# EasyEDA schematic schematic.json
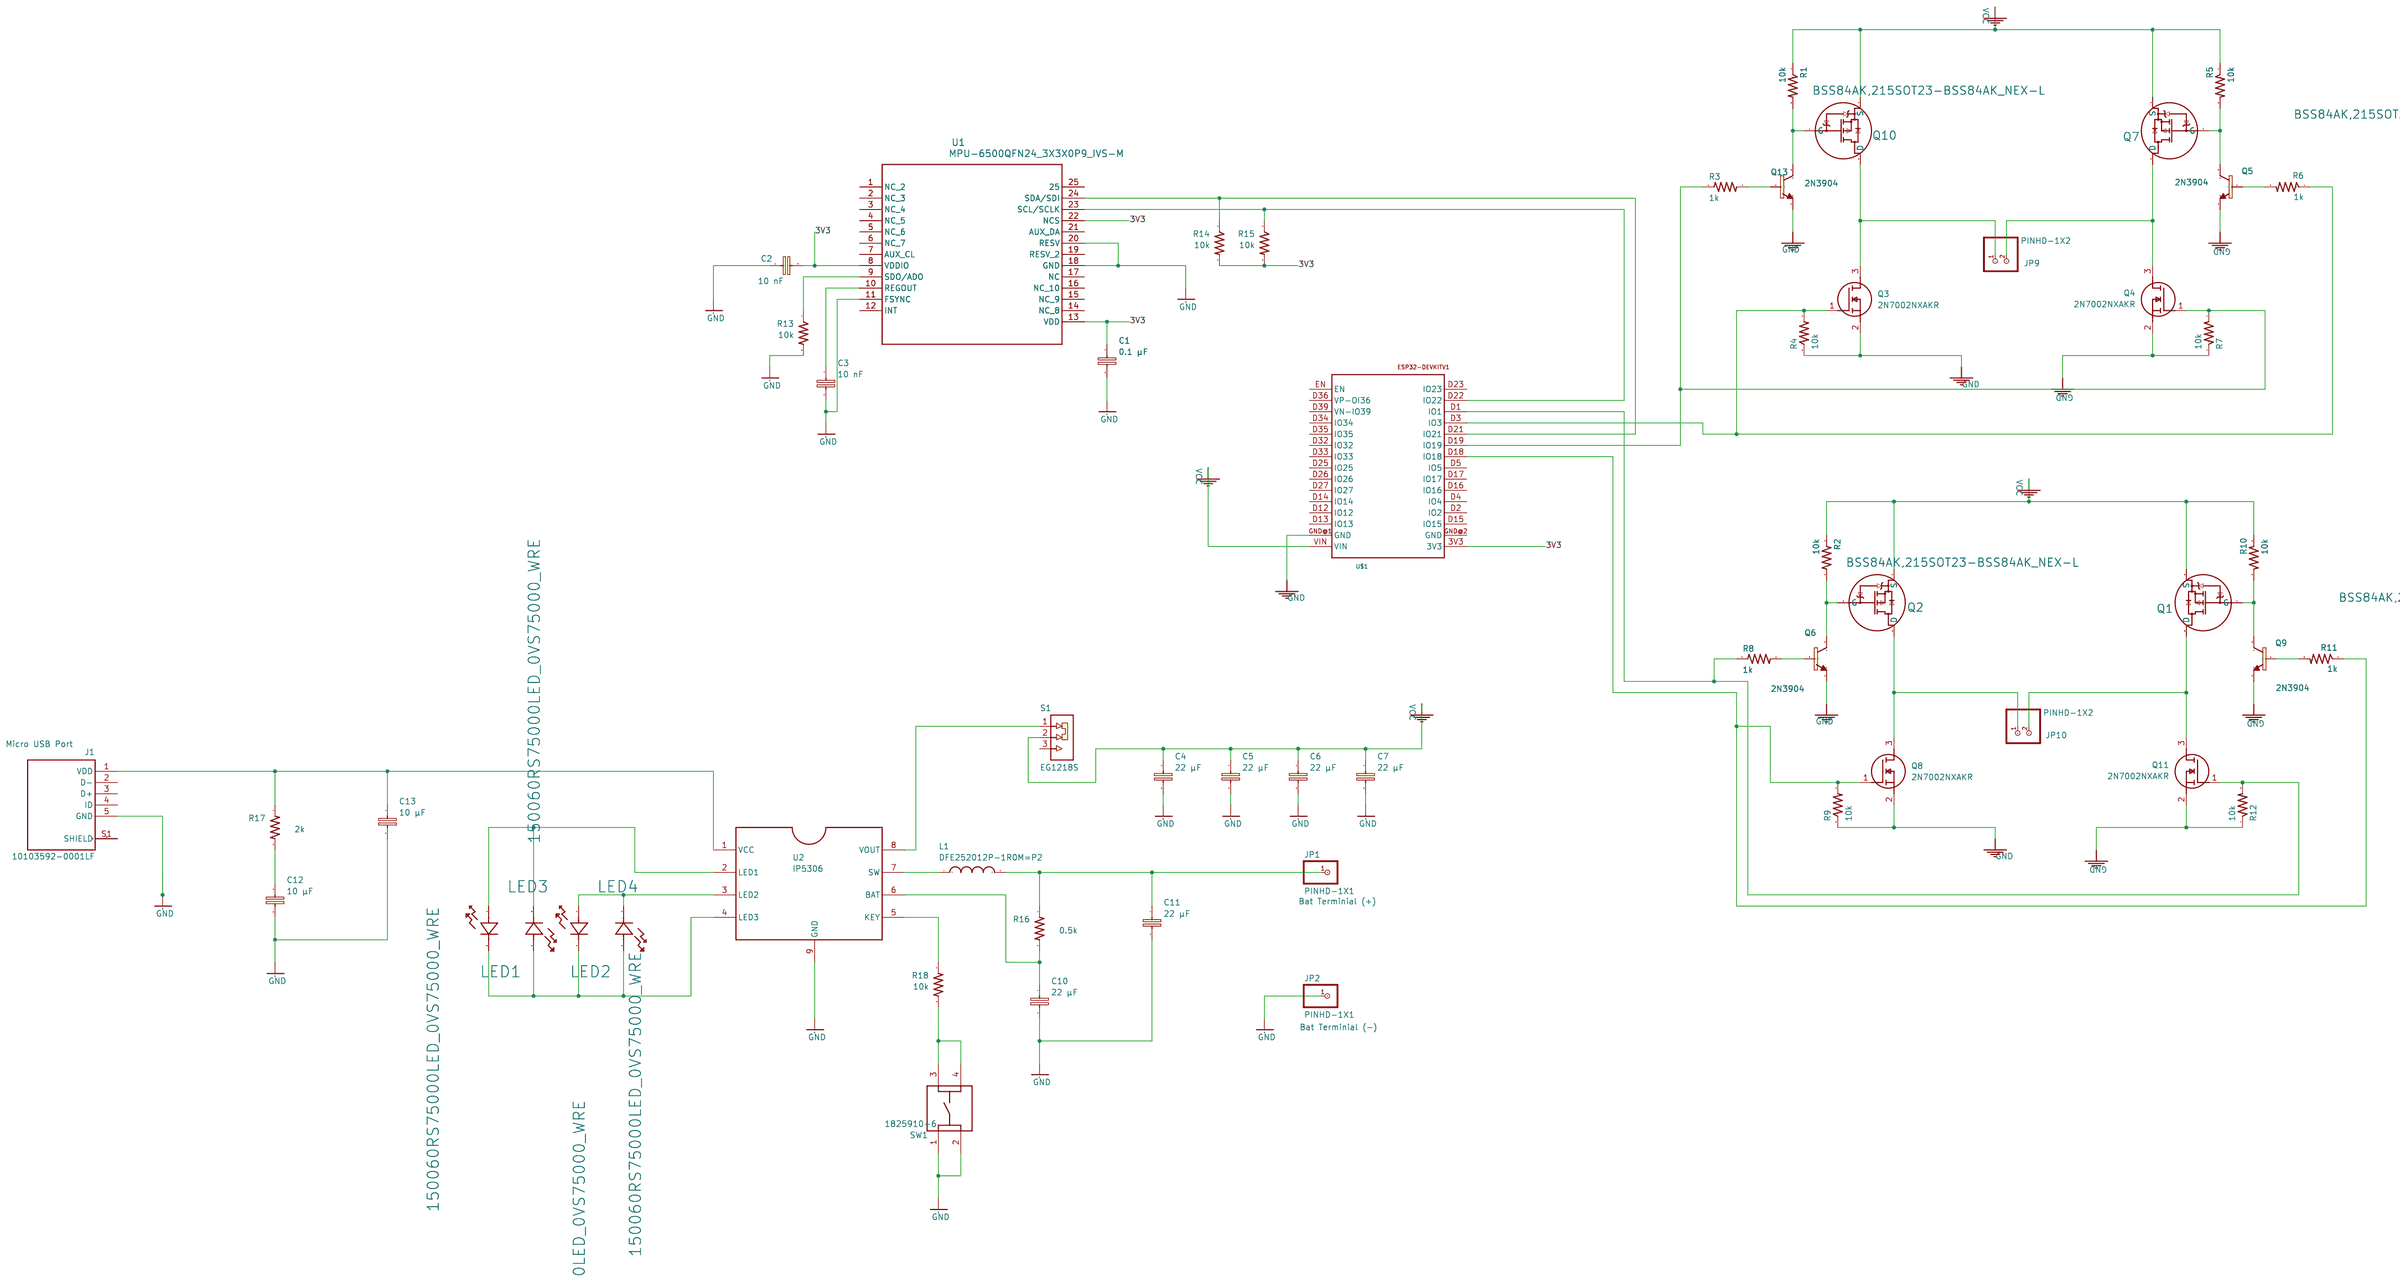
[diagram p0: schematic sheet]

## Parts
C1  0.1 µF  [CAPC2012X110]
C2  10 nF  [CAPC2012X110]
C3  10 nF  [CAPC2012X110]
C4  22 µF  [CAPC2012X110]
C5  22 µF  [CAPC2012X110]
C6  22 µF  [CAPC2012X110]
C7  22 µF  [CAPC2012X110]
C10  22 µF  [CAPC2012X110]
C11  22 µF  [CAPC2012X110]
C12  10 µF  [CAPC2012X110]
C13  10 µF  [CAPC2012X110]
J1  10103592-0001LF  [AMPHENOL_10103592-0001LF]
JP1  PINHD-1X1  [1X01]
JP2  PINHD-1X1  [1X01]
JP9  PINHD-1X2  [1X02]
JP10  PINHD-1X2  [1X02]
L1  DFE252012P-1R0M=P2  [INDC2520X120N]
LED1  150060RS75000LED_0VS75000_WRE  [LED_0VS75000_WRE]
LED2  150060RS75000LED_0VS75000_WRE  [LED_0VS75000_WRE]
LED3  150060RS75000LED_0VS75000_WRE  [LED_0VS75000_WRE]
LED4  150060RS75000LED_0VS75000_WRE  [LED_0VS75000_WRE]
Q1  BSS84AK,215SOT23-BSS84AK_NEX-L  [SOT23-BSS84AK_NEX-L]
Q2  BSS84AK,215SOT23-BSS84AK_NEX-L  [SOT23-BSS84AK_NEX-L]
Q3  2N7002NXAKR  [SOT95P230X110-3N]
Q4  2N7002NXAKR  [SOT95P230X110-3N]
Q5  2N3904  [TO92127P495H495-3]
Q6  2N3904  [TO92127P495H495-3]
Q7  BSS84AK,215SOT23-BSS84AK_NEX-L  [SOT23-BSS84AK_NEX-L]
Q8  2N7002NXAKR  [SOT95P230X110-3N]
Q9  2N3904  [TO92127P495H495-3]
Q10  BSS84AK,215SOT23-BSS84AK_NEX-L  [SOT23-BSS84AK_NEX-L]
Q11  2N7002NXAKR  [SOT95P230X110-3N]
Q13  2N3904  [TO92127P495H495-3]
R1  10k  [R0603]
R2  10k  [R0603]
R3  1k  [R0603]
R4  10k  [R0603]
R5  10k  [R0603]
R6  1k  [R0603]
R7  10k  [R0603]
R8  1k  [R0603]
R9  10k  [R0603]
R10  10k  [R0603]
R11  1k  [R0603]
R12  10k  [R0603]
R13  10k  [R0603]
R14  10k  [R0603]
R15  10k  [R0603]
R16  0.5k  [R0603]
R17  2k  [R0603]
R18  10k  [R0603]
S1  EG1218S  [SW_EG1218]
SUPPLY1  GND
SUPPLY2  GND
SUPPLY3  GND
SUPPLY4  GND
SUPPLY5  GND
SUPPLY6  GND
SUPPLY7  GND
SUPPLY8  GND
SUPPLY9  GND
SUPPLY10  GND
SUPPLY12  GND
SUPPLY13  GND
SUPPLY14  GND
SUPPLY15  GND
SUPPLY16  GND
SW1  1825910-6  [SW_1825910-6-4]
U1  MPU-6500QFN24_3X3X0P9_IVS-M  [QFN24_3X3X0P9_IVS-M]
U2  IP5306  [SOIC9P127_490X600X170L84X42T330X241N]
U$1  ESP32DEVKITV1  [ESP32-DEVKITV1]

## Library data of the parts
C1-C7 C10-C13 = -: SPICEMODEL: >SPICEMODEL; SPICEEXTRA: >SPICEEXTRA

## Nets
3V3: C1.1 C2.2 R14.2 R15.2 U1.8(VDDIO) U1.13(VDD) U1.22(NCS) U$1.3V3
GND: Q3.2(S) Q4.2(S) Q5.1(E) Q6.1(E) Q8.2(S) Q9.1(E) Q11.2(S) Q13.1(E) R4.1 R7.1 R9.1 R12.1 U$1.GND@1(GND)
VCC: C4.1 C5.1 C6.1 C7.1 Q1.2(S) Q2.2(S) Q7.2(S) Q10.2(S) R1.1 R2.1 R5.1 R10.1 S1.2(COM) U$1.VIN
Net-(C1-2): C1.2 SUPPLY2.(GND)
Net-(C2-1): C2.1 SUPPLY3.(GND)
Net-(C3-1): C3.1 U1.10(REGOUT)
Net-(C3-2): C3.2 SUPPLY5.(GND) U1.11(FSYNC)
Net-(C4-2): C4.2 SUPPLY8.(GND)
Net-(C5-2): C5.2 SUPPLY9.(GND)
Net-(C6-2): C6.2 SUPPLY12.(GND)
Net-(C7-2): C7.2 SUPPLY13.(GND)
Net-(C10-1): C10.1 R16.2 U2.6(BAT)
Net-(C10-2): C10.2 C11.2 SUPPLY7.(GND)
Net-(C11-1): C11.1 JP1.1 L1.2 R16.1
Net-(C12-1): C12.1 R17.2
Net-(C12-2): C12.2 C13.2 SUPPLY14.(GND)
Net-(C13-1): C13.1 J1.1(VDD) R17.1 U2.1(VCC)
Net-(J1-5): J1.5(GND) SUPPLY15.(GND)
Net-(J1-S1): J1.S1(SHIELD) J1.S2(SHIELD) J1.S3(SHIELD) J1.S4(SHIELD) J1.S5(SHIELD) J1.S6(SHIELD)
Net-(JP2-1): JP2.1 SUPPLY10.(GND)
Net-(JP9-1): JP9.1 Q3.3(D) Q10.3(D)
Net-(JP9-2): JP9.2 Q4.3(D) Q7.3(D)
Net-(JP10-1): JP10.1 Q2.3(D) Q8.3(D)
Net-(JP10-2): JP10.2 Q1.3(D) Q11.3(D)
Net-(L1-1): L1.1 U2.7(SW)
Net-(LED1-1): LED1.1 LED3.2 U2.2(LED1)
Net-(LED1-2): LED1.2 LED2.2 LED3.1 LED4.1 U2.4(LED3)
Net-(LED2-1): LED2.1 LED4.2 U2.3(LED2)
Net-(Q1-1): Q1.1(G) Q9.3(C) R10.2
Net-(Q2-1): Q2.1(G) Q6.3(C) R2.2
Net-(Q3-1): Q3.1(G) R4.2 R6.1 U$1.D3(IO3)
Net-(Q4-1): Q4.1(G) R3.1 R7.2 U$1.D19(IO19)
Net-(Q5-2): Q5.2(B) R6.2
Net-(Q5-3): Q5.3(C) Q7.1(G) R5.2
Net-(Q6-2): Q6.2(B) R8.2
Net-(Q8-1): Q8.1(G) R9.2 R11.1 U$1.D18(IO18)
Net-(Q9-2): Q9.2(B) R11.2
Net-(Q10-1): Q10.1(G) Q13.3(C) R1.2
Net-(Q11-1): Q11.1(G) R8.1 R12.2 U$1.D1(IO1)
Net-(Q13-2): Q13.2(B) R3.2
Net-(R13-1): R13.1 U1.9(SDO/ADO)
Net-(R13-2): R13.2 SUPPLY4.(GND)
Net-(R14-1): R14.1 U1.24(SDA/SDI) U$1.D21(IO21)
Net-(R15-1): R15.1 U1.23(SCL/SCLK) U$1.D22(IO22)
Net-(R18-1): R18.1 U2.5(KEY)
Net-(R18-2): R18.2 SW1.3 SW1.4
Net-(S1-1): S1.1(NC) U2.8(VOUT)
Net-(SUPPLY1-): SUPPLY1.(GND) U1.18(GND) U1.20(RESV)
Net-(SUPPLY6-): SUPPLY6.(GND) U2.9(GND)
Net-(SUPPLY16-): SUPPLY16.(GND) SW1.1 SW1.2

Not connected (* = marked no-connect by the designer): J1 2(D-) 3(D+) 4(ID); S1 3(NO); U1 1(NC_2) 2(NC_3) 3(NC_4) 4(NC_5) 5(NC_6) 6(NC_7) 7(AUX_CL) 12(INT) 14(NC_8) 15(NC_9) 16(NC_10) 17(NC) 19(RESV_2) 21(AUX_DA) 25; U$1 D2(IO2) D4(IO4) D5(IO5) D12(IO12) D13(IO13) D14(IO14) D15(IO15) D16(IO16) D17(IO17) D23(IO23) D25(IO25) D26(IO26) D27(IO27) D32(IO32) D33(IO33) D34(IO34) D35(IO35) D36(VP-OI36) D39(VN-IO39) EN GND@2(GND)

## Notes on the sheet
- Micro USB Port
- Bat Terminial (+)
- Bat Terminial (-)
